# Altium project Energy_meter.PrjPcb
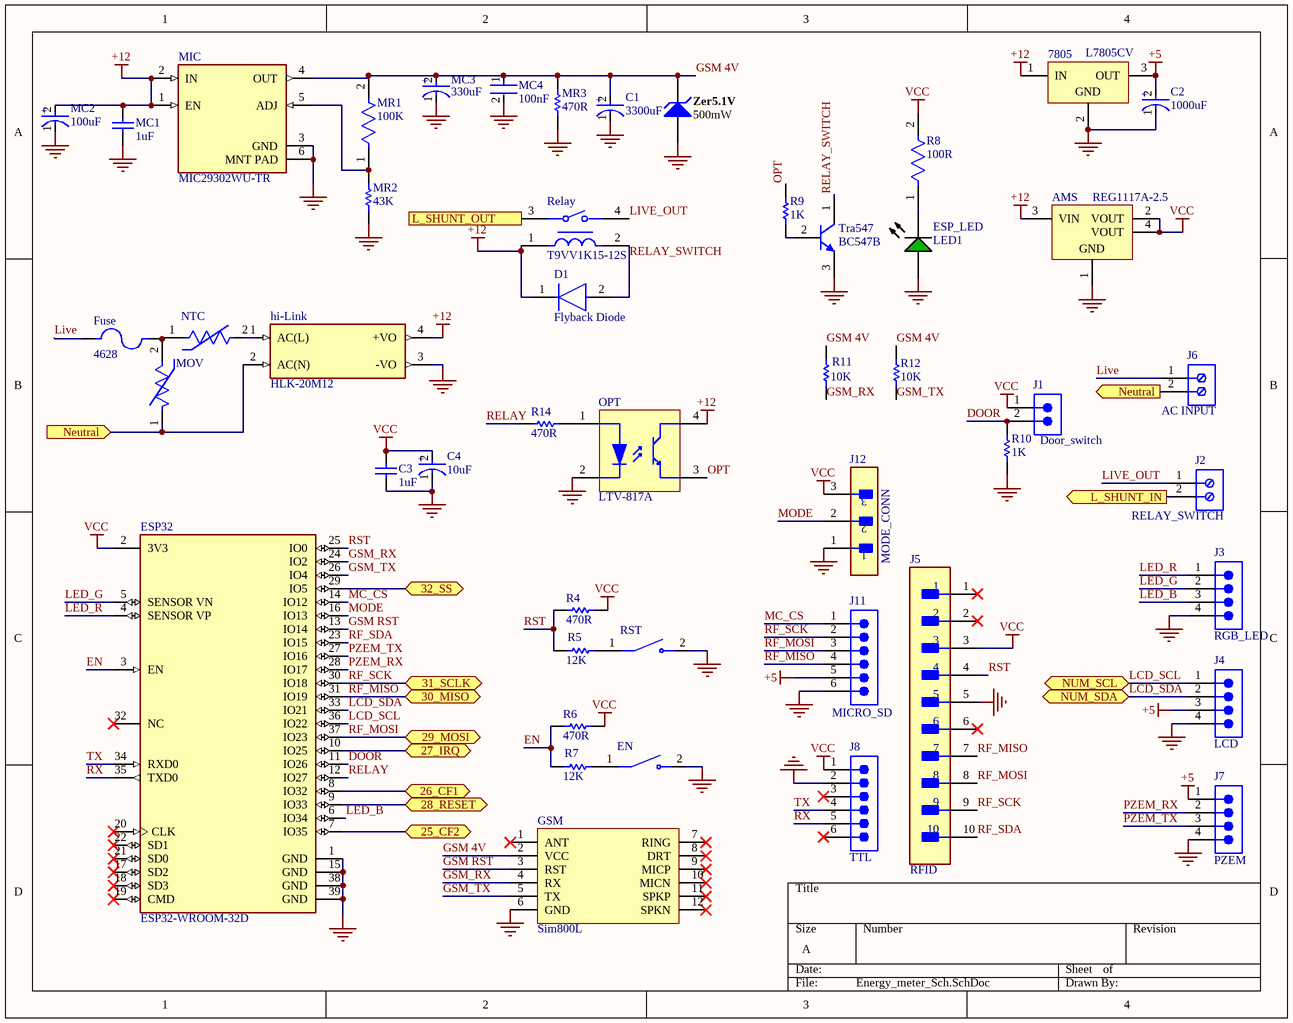
[diagram p0: Energy_meter_Sch.SchDoc]
2 sheets, 87 parts. Net scope: flat (ports and power ports of the same name join across sheets).
Board file: Energy_meter.PcbDoc
Sheets:
  Energy_meter_Sch.SchDoc
  EnergyMeter_ADE9153.SchDoc

## Sheet Energy_meter_Sch.SchDoc
size A; SheetNumber: 1; SheetTotal: 2

### Parts
7805  L7805CV  [TO220]
AMS  REG1117A-2.5  [DCY0004A_L]
C1  3300uF  [FP-RAD-TH-D_12_5_0_5-L_40-MFG]
C2  1000uF  [FP-RAD-TH-D_12_5_0_5-L_20-MFG]
C3  1uF  [CAPC2013X145X50ML20T25]
C4  10uF  [FP-SC-MFG]
D1  Flyback Diode  [FP-1N4007-MFG]
EN  TS09-63-25-WT-160-SMT-TR  [SW_TS09-63-25-WT-160-SMT-TR]  (value not drawn)
ESP32  ESP32-WROOM-32D  [FP-ESP32-WROOM-32D-MFG]
ESP_LED  LED1  [AVAG-HSMX-C170_V]
Fuse  4628  [FUSE_4628]
GSM  Sim800L  [Sim800L]
hi-Link  HLK-20M12  [CONV_HLK-20M12]
J1  Door_switch  [61300211121]
J2  RELAY_SWITCH  [691137710002]
J3  RGB_LED  [61300411121]
J4  LCD  [61300411121]
J5  RFID  [FP-B10B-XH-A_LF_SN-MFG]
J6  AC INPUT  [691137710002]
J7  PZEM  [61300411121]
J8  TTL  [61300611121]
J11  MICRO_SD  [61300611121]
J12  MODE_CONN  [FP-22-28-4030-MFG]
MC1  1uF  [CAPC2013X145X50LL20T25]
MC2  100uF  [FP-SC-MFG]
MC3  330uF  [FP-FPG-MFG]
MC4  100nF  [FP-0805-L_2_01_0_2-W_1_25-IPC_B]
MIC  MIC29302WU-TR  [FP-C04-012-MFG]
MOV  MOV1  [FP-MOV-10D201KTR-MFG]  (value not drawn)
MR1  100K  [FP-RN732A-MFG]
MR2  43K  [RESC2013X60X40NL20T25]
MR3  470R  [RESC2013X70X40ML20T20]
NTC  NTC1  [FP-NTPAA-MFG]  (value not drawn)
OPT  LTV-817A  [LTST-LTV-817-4]
R4  470R  [RESC2013X60X40ML20T25]
R5  12K  [RESC2013X60X40ML20T25]
R6  470R  [RESC2013X60X40ML20T25]
R7  12K  [RESC2013X60X40ML20T25]
R8  100R  [FP-RN732A-MFG]
R9  1K  [RESC2013X60X40ML20T25]
R10  1K  [RESC2013X60X35ML10T20]
R11  10K  [RESC2013X60X40ML20T25]
R12  10K  [RESC2013X60X40ML20T25]
R14  470R  [RESC2013X60X40ML20T25]
Relay  T9VV1K15-12S  [FP-T9VV1K15-12S-MFG]
RST  TS09-63-25-WT-160-SMT-TR  [SW_TS09-63-25-WT-160-SMT-TR]  (value not drawn)
Tra547  BC547B  [ONSC-TO-92-3-29-11]
Zer5.1V  500mW  [FAIR-DO-41-2_V]

### Ports
25_CF2 (bidir, see EnergyMeter_ADE9153), 26_CF1 (bidir, see EnergyMeter_ADE9153), 27_IRQ (bidir, see EnergyMeter_ADE9153), 28_RESET (bidir, see EnergyMeter_ADE9153), 29_MOSI (bidir, see EnergyMeter_ADE9153), 30_MISO (bidir, see EnergyMeter_ADE9153), 31_SCLK (bidir, see EnergyMeter_ADE9153), 32_SS (bidir, see EnergyMeter_ADE9153), L_SHUNT_IN (out, see EnergyMeter_ADE9153), L_SHUNT_OUT (in, see EnergyMeter_ADE9153), Neutral (in, see Energy_meter_Sch, EnergyMeter_ADE9153), Neutral (out, see Energy_meter_Sch, EnergyMeter_ADE9153), NUM_SCL (bidir, see EnergyMeter_ADE9153), NUM_SDA (bidir, see EnergyMeter_ADE9153)

### Nets
+5: 7805.3(OUT) C2.2(A) J4.3 J7.1 J11.5
+12: 7805.1(IN) AMS.3(VIN) D1.1(C) hi-Link.4(+VO) MC1.2 MC2.2(A) MIC.1(EN) MIC.2(IN) OPT.4(COLLECTOR) Relay.1
GND: 7805.2(GND) AMS.1(GND) C1.1(C) C2.1(C) C3.1 C4.1(C) EN.2 ESP32.1(GND) ESP32.15(GND) ESP32.38(GND) ESP32.39(GND) ESP_LED.1(A) GSM.6(GND) hi-Link.3(-VO) J2.2 J3.4 J4.4 J5.5 J7.4 J8.2 J11.6 J12.1 MC1.1 MC2.1(C) MC3.1(C) MC4.2 MIC.3(GND) MIC.6(MNT_PAD) MR2.1 MR3.1 OPT.2(CATHODE) R10.1 RST.2 Tra547.3(E) Zer5.1V.1(A) ; port L_SHUNT_IN
VCC: AMS.2(VOUT) AMS.4(VOUT) C3.2 C4.2(A) ESP32.2(3V3) J1.1 J5.3 J8.1 J12.3 R4.2 R6.2 R8.2
6_IAMS: Relay.3 ; port L_SHUNT_OUT
DOOR: ESP32.11(IO26) J1.2 R10.2
EN: ESP32.3(EN) R6.1 R7.1
GSM 4V: C1.2(A) GSM.2(VCC) MC3.2(A) MC4.1 MIC.4(OUT) MR1.2 MR3.2 R11.2 R12.2 Zer5.1V.2(K)
GSM RST: ESP32.13(IO14) GSM.3(RST)
GSM_RX: ESP32.24(IO2) GSM.4(RX) R11.1
GSM_TX: ESP32.26(IO4) GSM.5(TX) R12.1
LCD_SCL: ESP32.36(IO22) J4.1 ; port NUM_SCL
LCD_SDA: ESP32.33(IO21) J4.2 ; port NUM_SDA
LED_B: ESP32.6(IO34) J3.3
LED_G: ESP32.5(SENSOR_VN) J3.2
LED_R: ESP32.4(SENSOR_VP) J3.1
Live: Fuse.1 J6.1
LIVE_OUT: J2.1 Relay.4
MC_CS: ESP32.14(IO12) J11.1
MODE: ESP32.16(IO13) J12.2
OPT: OPT.3(EMITTER) R9.2
PZEM_RX: ESP32.28(IO17) J7.2
PZEM_TX: ESP32.27(IO16) J7.3
RELAY: ESP32.12(IO27) R14.1
RELAY_SWITCH: D1.2(A) Relay.2 Tra547.1(C)
RF_MISO: ESP32.31(IO19) J5.7 J11.4 ; port 30_MISO
RF_MOSI: ESP32.37(IO23) J5.8 J11.3 ; port 29_MOSI
RF_SCK: ESP32.30(IO18) J5.9 J11.2 ; port 31_SCLK
RF_SDA: ESP32.23(IO15) J5.10
RST: ESP32.25(IO0) J5.4 R4.1 R5.1
RX: ESP32.35(TXD0) J8.5
TX: ESP32.34(RXD0) J8.4
NetADE_25: ESP32.7(IO35) ; port 25_CF2
NetADE_26: ESP32.8(IO32) ; port 26_CF1
NetADE_27: ESP32.10(IO25) ; port 27_IRQ
NetADE_28: ESP32.9(IO33) ; port 28_RESET
NetADE_32: ESP32.29(IO5) ; port 32_SS
NetEN_1: EN.1 R7.2
NetESP_LED_2: ESP_LED.2(K) R8.1
NetFuse_2: Fuse.2 MOV.2 NTC.1
Nethi-Link_1: hi-Link.1(AC(L)) NTC.2
Nethi-Link_2: hi-Link.2(AC(N)) J6.2 MOV.1 ; port Neutral
NetMIC_5: MIC.5(ADJ) MR1.1 MR2.2
NetOPT_1: OPT.1(ANODE) R14.2
NetR5_2: R5.2 RST.1
NetR9_1: R9.1 Tra547.2(B)

Not connected (* = marked no-connect by the designer): ESP32 17(SD2)* 18(SD3)* 19(CMD)* 20(CLK)* 21(SD0)* 22(SD1)* 32(NC)*; GSM 1(ANT)* 7(RING)* 8(DRT)* 9(MICP)* 10(MICN)* 11(SPKP)* 12(SPKN)*; J5 1* 2* 6*; J8 3* 6*

### Notes on the sheet
- (in symbol CMP-05427-000047-1) +
- (in symbol CMP-05427-000057-1) +
- (in symbol CMP-05427-000087-1) +
- (in symbol CMP-05427-000606-1) +
- (in symbol CMP-05427-001733-1) +

### Library data of the parts
7805 = CMP-0244-00483-1: Positive Voltage Regulator, 5V, 3-Pin TO-220; PackageDescription: TO, Thru-Hole, Vertical, Heatsink Mounted; 3 In-Line Leads; Pitch 2.54 mm; ComponentLink2Description: Datasheet; PackageReference: TO220; ComponentLink3URL: http://www.st.com/internet/com/TECHNICAL_RESOURCES/TECHNICAL_LITERATURE/PACKAGE_INFORMATION/CD00004649.pdf; DatasheetVersion: 16/11/2011; ComponentLink1Description: Manufacturer URL; ComponentLink1URL: http://www.st.com; PackageVersion: ver3.0; ComponentLink3Description: Package Specification; ComponentLink2URL: http://www.st.com/internet/com/TECHNICAL_RESOURCES/TECHNICAL_LITERATURE/DATASHEET/CD00000444.pdf
AMS = CMP-0395-00519-2: Single Output LDO, 1 A, Fixed 2.5 V Output, 3.8 to 15 V Input, with Internal Current Limiting, 4-pin SOT-223 (DCY), -40 to 125 degC, Green (RoHS & no Sb/Br); Manufacturer: Texas Instruments; SubFamily: Single Channel LDO; Vdo(Typ)(mV): 1200; Vin(Min)(V): 3.8; Fixed Output Options(V): 2.5; Rating: Catalog; Vin(Max)(V): 15; Iout(Max)(A): 1; Iq(Typ)(mA): 4; Eco-Plan: Green (RoHS & no Sb/Br); PackageReference: DCY0004A; PartNumber: REG1117A-2.5; DatasheetVersion: SBVS001D; ComponentLink1Description: Manufacturer URL; Vout Adj(Min)(V): 2.5; Mounting Technology: Surface Mount; PackageDescription: 4-Pin Plastic Small Outline, Body 3.5 x 6.5 mm, Pitch 2.3 mm; Vout Adj(Max)(V): 2.5; Code_JEDEC: TO-261; ComponentLink3URL: http://www.ti.com/litv/pdf/mpds094a; ComponentLink2URL: http://www.ti.com/general/docs/lit/getliterature.tsp?genericPartNumber=REG1117A-25&fileType=pdf; ComponentLink2Description: Datasheet; ComponentLink3Description: Package Specification; PackageVersion: 4202506/B; ComponentLink1URL: http://www.ti.com/
C1 = CMP-05427-001733-1: Aluminum Electrolytic Capacitors (Radial Lead Type) AEC-Q200 Qualified 3300uF ±20% 25V; Life (Hours): 5000Hour; Dielectric Material: Aluminium; Impedance: 14mR; Capacitance: 3.3mF; Ripple Current: 3.01A; Lead Diameter: 0.8mm; Contact Plating: Tin; Min Operating Temperature: -55°C; Termination: Radial; REACH SVHC: No SVHC; RoHS Compliant: Yes; Series: FK; Number of Pins: 2; Package Quantity: 100; Case/Package: Radial; Lead Pitch: 5mm; Voltage Rating (DC): 25V; Radiation Hardening: No; Tolerance: 20%; Construction: RADIAL; Mount: Through Hole; Diameter: 12.5mm; Packaging: Bulk; Max Operating Temperature: 105°C; Voltage Rating: 25V; Voltage: 25V; Height: 40mm
C2 = CMP-05427-000606-1: Aluminum Electrolytic Capacitors (Radial Lead Type) 1000uF ±20% 25V; Lead Length: 17mm; ESR (Equivalent Series Resistance): 18mR; Dissipation Factor: 0.14%; Lead Diameter: 0.6mm; Dielectric Material: Aluminium; Capacitance: 1mF; Life (Hours): 5000Hour; Ripple Current: 2.6A; Contact Plating: Tin; Voltage: 25V; Length: 20mm; Packaging: Bulk; RoHS Compliant: Yes; REACH SVHC: Yes; Lead Free: Lead Free; Tolerance: 20%; Features: General Purpose; Construction: RADIAL; Lead Pitch: 5mm; Impedance: 18mR; Min Operating Temperature: -40°C; Case/Package: Radial; Diameter: 12.5mm; Height - Seated (Max): 0.787inch; Package Quantity: 200; Mount: Through Hole; Max Operating Temperature: 105°C; Series: FM; Height: 20mm; Voltage Rating (DC): 25V; Termination: Radial; Voltage Rating: 25V; Radiation Hardening: No
C3 = CMP-1036-04731-2: Part Number: C0805C105K9PACTU; Manufacturer: Kemet
C4 = CMP-05427-000087-1: CAP ALUM 10UF 20% 35V SMD; Life (Hours): 2000Hour; Lead Length: 2.2mm; Ripple Current (AC): 30mA; Leakage Current: 3uA; Length: 5.5mm; Construction: Cylindrical; Diameter: 5mm; RoHS Compliant: Yes; REACH SVHC: No SVHC; Capacitance: 10uF; Max Operating Temperature: 85°C; Series: S; Case/Package: Radial; Contact Plating: Tin; Packaging: Tape and Reel; Voltage Rating: 35V; Number of Pins: 2; Height: 5.4mm; Width: 5.3mm; Voltage Rating (DC): 35V; Mount: Surface Mount; Tolerance: 20%; Lead Pitch: 1.5mm; Radiation Hardening: No; Height - Seated (Max): 0.213inch; Ripple Current: 30mA; Voltage: 35V; Package Quantity: 1; Termination: SMD/SMT; Min Operating Temperature: -40°C
D1 = CMP-02540-000046-1: DIODE GEN PURP 1KV 1A DO204AL; Manufacturer: Vishay; Manufacturer Part Number: 1N4007-E3/54; Value: 15pF; Max Junction Temp: +150°C; Max Surge Forward Current: 30A; Max Repetitive Reverse Voltage: 1000V; Peak Reverse Current: 30uA; Octopart: https://octopart.com/1n4007-e3%2F54-vishay-39548207; Digikey Description: DIODE GEN PURP 1KV 1A DO204AL; Category: Diode; Mouser Description: Rectifiers Vr/1000V Io/1A; Automotive: No; Package: 1N4007; Device Class L3: Rectifier Diodes; Temperature Range High: +150°C; Capacitance: 15pF; Ipc Land Pattern Name: DIOPA1088W105L520D270; Lead Free: Yes; ComponentLink2Description: Datasheet; Forward Current: 1A; Device Class L1: Discrete Semiconductors; ComponentLink2URL: http://www.vishay.com/docs/88503/1n4001.pdf; Temperature Range Low: -50°C; Height: 2.7mm; RoHS: TRUE; Temperature: -50°C to +150°C; Device Class L2: Diodes
ESP32 = CMP-194065-000003-1: WIFI MODULE 32MBITS SPI FLASH; Manufacturer: Espressif Systems; Max Supply Voltage: 3.6V; Nominal Supply Current: 500mA; Max Frequency: 2484MHz; Number Of Adc Channels: 16; Number Of Gpio: 32; Interface: I2C,SPI,UART,Ethernet,I2S,Other; Data Rate: 150Mbits/s; Min Supply Voltage: 3V; Bandwidth: 72MHz; Sensitivity: -98dBm; Octopart: https://octopart.com/esp32-wroom-32d-espressif+systems-91040050; Package: ESP32-WROOM-32D; ComponentLink2URL: https://www.espressif.com/sites/default/files/documentation/esp32-wroom-32d_esp32-wroom-32u_datasheet_en.pdf; Lead Free: Yes; Category: UNK; Mouser Description: Wi-Fi/BT BLE Module ESP32-D0WD, SPI Flash, UART, P; Device Class L1: Integrated Circuits (ICs); RoHS: TRUE; Temperature Range Low: -40°C; ComponentLink2Description: Datasheet; Digikey Description: WIFI MODULE 32MBITS SPI FLASH; Height: 3.2mm; Temperature: -40°C to +85°C; Manufacturer Part Number: ESP32-WROOM-32D; Device Class L3: Transceivers; Device Class L2: RF Semiconductors and Devices; Temperature Range High: +85°C; Automotive: No
ESP_LED = CMP-2000-05062-1: Chip LED, Green, 2.2 V, -40 to 85 degC, 2-Pin SMD, Pb-Free, Tape and Reel; Manufacturer: Avago; No. of Pins: 2; Peak Wavelength: 570nm; SVHC: NoSVHC(16-Jun-2014); Dominant Wavelength: 572nm; Forward Current If: 20mA; Viewing Angle: 170deg; Lens Shape: Rectangular; PIV Max: 5V; External Width: 1.25mm; LED Type: Standard; External Depth: 0.8mm; Opto Mounting Orientation: Top; Luminous Intensity: 15mcd; Luminous Intensity Min: 4mcd; Forward Voltage VF Max: 2.6V; External Length / Height: 2mm; Bulb Size: 1.25mmx1.4mm; Light Area Height: 1mm; Voltage Vf Typ: 2.2V; Operating Temperature Max: 85degC; Datasheet Version: Oct-08; MSL: MSL2A-4weeks; Peak Forward Current: 20mA; Package Description: 2-Pin Surface Mount Device, Body 2 x 1.25 mm, Height 0.8 mm; Datasheet URL: https://datasheet.ciiva.com/29280/180495-da-01-en-chip-led-hsmg-c170-gelb-gruen-29280971.pdf; Storage Temperature Min: -40degC; LED Colour: Green; Wavelength Typ: 570nm; Mounting Type: SMD; Forward Current If Max: 20mA; Dominant Wavelength Typ: 572nm; LED Mounting: SMD; Operating Temperature Range: -30degCto+85degC; Operating Temperature Min: -30degC; Manufacturer URL: http://www.avagotech.com/; Packaging: CutTape; Luminous Intensity Typ: 15mcd; Package Reference: HSMX-C170; Storage Temperature Max: 85degC; Opto Case Style: SMD; Forward Voltage: 2.2V
Fuse = 4628: 5mm Slim Line Fuse holder; MF: Keystone; Check_prices: https://www.snapeda.com/parts/4628/Keystone/view-part/?ref=eda; Value: *; Availability: In Stock; MP: 4628; Price: None; Package: None; SnapEDA_Link: https://www.snapeda.com/parts/4628/Keystone/view-part/?ref=snap; Purchase-URL: https://pricing.snapeda.com/search/part/4628/?ref=eda
hi-Link = HLK-20M12: 20W ultra-small series module power supply; MF: Hi-link; Check_prices: https://www.snapeda.com/parts/HLK-20M12/Hi-link/view-part/?ref=eda; SnapEDA_Link: https://www.snapeda.com/parts/HLK-20M12/Hi-link/view-part/?ref=snap; Availability: Not in stock; Price: None; Value: *; MP: HLK-20M12; Package: Non-Standard Hi-link
J1 = CMP-1712-00002-5: NexarPartId: 20081794; Operating Supply Voltage: 250V; Current Rating: 3A; Gender: Male; Number of Contacts: 2; Pitch: 2.54mm; Connector Type: Male Pin; Contact Resistance: 20mΩ; Contact Plating: Gold; Contact Material: Copper; Number of Pins: 2; Min Operating Temperature: -40°C; Packaging: Bulk; Lead Pitch: 2.54mm; Mount: Through Hole; Orientation: Vertical; RoHS: Compliant; REACH SVHC: No SVHC; Height: 8.94mm; Termination: Through Hole; Number of Positions: 2; Contact Mating Length: 5.9944mm; Color: Black; Contact Gender: Male; Number of Rows: 1; Housing Material: PBT; Lead Free: Lead Free; Voltage Rating: 250V; Max Operating Temperature: 125°C
J2 J6 = CMP-1502-03324-2: NexarPartId: 78871135; Voltage Rating: 300V; Number of Contacts: 2; Current Rating: 16A; Lead Pitch: 5mm; Height: 11.6mm; Packaging: Box; RoHS: Non-Compliant; Contact Material: Nickel, Tin; Max Operating Temperature: 120°C; Number of Pins: 2; Min Operating Temperature: -30°C; Number of Rows: 1
J3 J4 J7 = CMP-1502-01064-2: NexarPartId: 32855522; Pitch: 2.54mm; Number of Contacts: 4; Contact Resistance: 20mΩ; Gender: Male; Current Rating: 3A; Connector Type: Male Pin; Voltage Rating: 250V; Lead Free: Lead Free; Contact Plating: Gold; Max Operating Temperature: 105°C; Packaging: Bulk; Height: 8.89mm; Orientation: Vertical; Contact Mating Length: 5.9944mm; Contact Material: Copper; Lead Pitch: 2.54mm; Min Operating Temperature: -40°C; Termination: Solder; Color: Black; Number of Rows: 1; REACH SVHC: Unknown; RoHS: Compliant; Mount: Through Hole; Number of Positions: 4; Number of Pins: 4; Operating Supply Voltage: 250V
J5 = CMP-17439-000145-1: CONN HEADER VERT 10POS 2.5MM; Voltage Rating: 250V; Current Rating: 3A; Wire/Cable Gauge: 22AWG; Number of Contacts: 10; Contact Resistance: 20mR; Mated Stacking Heights: 9.8mm; Gender: Male; Insulation Resistance: 1GR; Series: XH; Max Current Rating: 3A; Contact Shape: Square; Contact Material: Brass; Housing Material: Polyamide; Lead Free: Lead Free; Orientation: Straight; Max Voltage Rating (DC): 250V; Contact Type: Male Pin; Number of Positions: 10; Length: 27.4mm; Housing Color: White; Max Voltage Rating (AC): 250V; Depth: 5.75mm; Mount: Through Hole; Pitch: 2.5mm; Fastening Type: Detent; Flammability Rating: UL94 V-0; Color: Natural; Contact Plating: Tin; Insulation Color: Natural; Packaging: Bulk; REACH SVHC: No SVHC; Insulation Material: Nylon; Connector Type: Header; Lead Pitch: 2.5mm; Contact Finish - Mating: TIN; Voltage Rating (AC): 250V; Number of Rows: 1; Max Operating Temperature: 85°C; Min Operating Temperature: -25°C; Termination: Solder
J8 J11 = CMP-1502-01070-2: NexarPartId: 20084590; Operating Supply Voltage: 250V; Current Rating: 3A; Number of Contacts: 6; Gender: Male; Connector Type: Male Pin; Pitch: 2.54mm; Contact Resistance: 20mΩ; Lead Free: Lead Free; REACH SVHC: Unknown; Number of Rows: 1; Color: Black; Min Operating Temperature: -40°C; Contact Material: Copper; Lead Pitch: 2.54mm; Contact Plating: Gold; Number of Pins: 6; Height: 8.89mm; Orientation: Vertical; Termination: Through Hole; Mount: Through Hole; RoHS: Compliant; Contact Gender: Male; Contact Mating Length: 5.9944mm; Voltage Rating: 250V; Number of Positions: 6; Housing Material: PBT; Packaging: Bulk; Max Operating Temperature: 105°C
J12 = CMP-04776-000098-1: CONN HEADER VERT 3POS 2.54MM; Manufacturer: Molex; Conn Orientation: Vertical; Conn Gender: Male; Current Rating: 4A; Voltage Rating: 500V; Number Of Contacts: 3; Category: Conn; Number Of Rows: 1; Manufacturer Part Number: 22-28-4030; RoHS: TRUE; Package: 22-28-4030; Footprint Url: https://www.molex.com/pdm_docs/sd/022284030_sd.pdf; ComponentLink2Description: Datasheet; Device Class L2: Headers and Wire Housings; Automotive: No; Temperature Range Low: -40°C; Digikey Description: CONN HEADER VERT 3POS 2.54MM; Mouser Description: Headers & Wire Housings 3P VERT HEADER Sn; Contact Material: Gold,Nickel; Pitch: 2.54mm; Device Class L1: Connectors; Lead Free: Yes; Device Class L3: unset; Temperature Range High: +80°C; Octopart: https://octopart.com/0022284030-molex-10476094; ComponentLink2URL: https://www.molex.com/webdocs/datasheets/pdf/en-us/0022284030_PCB_HEADERS.pdf; Height: 8.88mm; Temperature: -40°C to +80°C
MC1 = CMP-1036-04746-2: Manufacturer: Kemet; Part Number: C0805C105K4PACTU
MC2 = CMP-05427-000047-1: CAP ALUM 100UF 20% 10V SMD; Life (Hours): 1000Hour; Ripple Current: 50mA; Packaging: Tape and Reel; Diameter: 5mm; Voltage Rating (DC): 10V; Mount: Surface Mount; Max Operating Temperature: 85°C; Length: 5.5mm; Case/Package: Radial; Height: 5.4mm; Construction: Cylindrical; Termination: SMD/SMT; Height - Seated (Max): 0.213inch; Series: S; Min Operating Temperature: -40°C; Capacitance: 100uF; Tolerance: 20%; Voltage Rating: 10V; Package Quantity: 1; Radiation Hardening: No; Ripple Current (AC): 50mA; Lead Free: Lead Free; RoHS Compliant: Yes; Contact Plating: Tin
MC3 = CMP-05427-000057-1: CAP ALUM 330UF 20% 35V SMD; ESR (Equivalent Series Resistance): 60mR; Dielectric Material: Aluminium; Life (Hours): 2000Hour; Ripple Current (AC): 1.19A; Leakage Current: 115.5uA; Polarity: Polar; Lead Free: Lead Free; Height - Seated (Max): 0.402inch; Diameter: 10mm; RoHS Compliant: Yes; Construction: Cylindrical; Material: Aluminium; Case/Package: Radial; Voltage Rating (DC): 35V; Voltage: 35V; Voltage Rating: 35V; Capacitance: 330uF; Height: 10.2mm; Lead Pitch: 4.6mm; Tolerance: 20%; Contact Plating: Tin; Number of Pins: 2; Width: 10.3mm; Termination: SMD/SMT; Max Operating Temperature: 105°C; Packaging: Tape and Reel; Package Quantity: 500; REACH SVHC: No SVHC; Series: FP; Min Operating Temperature: -55°C; Ripple Current: 1.19A; Mount: Surface Mount; Length: 10.5mm; Radiation Hardening: No
MC4 = CMP-2007-04174-2: General Purpose Ceramic Capacitor, 0805, 100nF, 10%, X7R, 15%, 100V; Packaging: Tape and Reel; Min Operating Temperature: -55°C; Dielectric Material: Ceramic; Height: 1.4mm; Voltage Rating: 100V; Termination: SMD/SMT; Case Code (Imperial): 0805; Case Code (Metric): 2012; Case/Package: 0805; Construction: Flat; Radiation Hardening: No; Series: -; Dielectric: X7R; Package Quantity: 2000; Mount: Surface Mount; Capacitance: 100nF; Contact Plating: Tin; Voltage: 100V; Lead Free: Lead Free; Depth: 1.25mm; RoHS Compliant: Yes; Number of Pins: 2; Max Operating Temperature: 125°C; Length: 2.01mm; Voltage Rating (DC): 100V; Thickness: 0.055inch; REACH SVHC: No SVHC; Width: 0.049inch; Tolerance: 10%
MIC = CMP-06324-000007-1: IC REG LINEAR POS ADJ 3A TO263-5; Manufacturer: Microchip; Output Voltage: 3.3-12V; Output Type: AdjustableProgrammable; Max Junction Temp: +125°C; Standoff Height: 0mm; Accuracy Percentage: 1%; Max Supply Voltage: 26V; Nominal Supply Current: 10-37mA; Number Of Outputs: 1; Dropout Voltage: 370mV; Min Supply Voltage: 2.25V; ComponentLink2URL: http://ww1.microchip.com/downloads/en/DeviceDoc/MIC2915x-30x-50x-75x-High-Current-Low-Dropout-Regulators-DS20005685B.pdf; Device Class L1: Integrated Circuits (ICs); Digikey Description: IC REG LINEAR POS ADJ 3A TO263-5; Device Class L2: Power Management ICs; Lead Free: Yes; Mouser Description: LDO Voltage Regulators; Package: C04-012; Temperature: -40°C to +125°C; ComponentLink2Description: Datasheet; Temperature Range High: +125°C; Automotive: No; Device Class L3: Voltage Regulators - Linear; Category: IC; Temperature Range Low: -40°C; RoHS: TRUE; Output Current: 3A; Octopart: https://octopart.com/mic29302wu-tr-microchip-66801318; Manufacturer Part Number: MIC29302WU-TR; Height: 0.2inch
MOV = CMP-07402-000009-1: VARISTOR 200V 2.5KA DISC 10MM; Manufacturer: Bourns Inc.; Manufacturer Part Number: MOV-10D201KTR; Voltage Rating Ac: 130V; Varistor Voltage: 185V; Voltage Rating Dc: 170V; Voltage Tolerance: 10%; Clamping Voltage: 340V; Capacitance: 600pF; Clamping Current: 25A; Value: 600pF; Device Class L2: Varistors; Automotive: No; Octopart: https://octopart.com/mov-10d201ktr-bourns-19184757; Temperature: -40°C to +105°C; RoHS: TRUE; Height: 15.5mm; Category: Res; Mouser Description: Varistors 250pF 200volts 10%; Lead Free: Yes; ComponentLink2Description: Datasheet; ComponentLink2URL: https://www.bourns.com/docs/Product-Datasheets/MOV10D.pdf; Temperature Range High: +105°C; Device Class L3: unset; Temperature Range Low: -40°C; Package: 0; Digikey Description: VARISTOR 200V 2.5KA DISC 10MM; Device Class L1: Circuit Protection
MR1 = CMP-03211-002801-1: SMD Chip Resistor, Thin Film, 100KΩ, 100 V, 0805 [2012 Metric], 100 mW, 0.1%, RN73 Series; Manufacturer Part Number: RN73C2A100KBTDF; Manufacturer: TE Connectivity; Temperature Coefficient: 10ppm/°C; Voltage Rating: 100V; Power Rating: 0.1W; Ipc Land Pattern Name: RESC200125X55; ComponentLink2URL: https://www.te.com/commerce/DocumentDelivery/DDEController?Action=showdoc&DocId=Data+Sheet%7F1773270%7FP%7Fpdf%7FEnglish%7FENG_DS_1773270_P.pdf%7F1676162-2; Package: RN732A; octopart_url: https://octopart.com/rn73c2a100kbtdf-te+connectivity-21411916; Lead Free: Yes; Temperature Range Low: -55°C; Temperature Range High: 155°C; Octopart: https://octopart.com/rn73c2a100kbtdf-te+connectivity-21411916; ComponentLink2Description: Datasheet; Category: Res; Device Class L1: Passive Components; Resistance: 100KΩ; Device Class L3: Chip SMD Resistors; Tolerance: 0.1%; packaging: 1000 Reel; Series: RN73; Value: 100KΩ; Composition: Thin Film; Temperature: -55°C to 155°C; RoHS: TRUE; Automotive: No; Device Class L2: Resistors; Height: 0.65mm
MR2 = CMP-2001-00640-1: Manufacturer: Panasonic; Part Number: ERA6AEB433V
MR3 = CMP-2001-00549-5: Chip Resistor, 470 Ohm, +/- 1%, 0.125 W, -55 to 155 degC, 0805 (2012 Metric), RoHS, Tape and Reel; Manufacturer: Panasonic; Voltage Rating: 150 V; ComponentLink1URL: http://www.panasonic.com/; ComponentLink2Description: Datasheet; RoHSCompliant: true; PackageDescription: 2-Pin Surface Mount Device, Body 2 x 1.25 mm; PackageReference: 0805; REACH SVHC: Yes; Max Operating Temperature: 155 degC; Mount: Surface Mount; Min Operating Temperature: -55 degC; DatasheetVersion: 04/2015; Mounting Technology: Surface Mount; Height: 0.6 mm; Package Quantity: 1; ComponentLink2URL: http://industrial.panasonic.com/cdbs/www-data/pdf/RDA0000/AOA0000C86.pdf; Length: 2 mm; ComponentLink1Description: Manufacturer URL; Pins: 2; Packaging: Cut Tape
NTC = CMP-06022-000066-1: ICL 3.9 OHM 15% 2.7A 10MM; Resistance: 3.9R; Lead Diameter: 0.8mm; Voltage: 264V; Current Rating: 2.3A; Mount: Through Hole; Packaging: Bulk; Max Operating Temperature: 160°C; Package Quantity: 100; Diameter: 0.394inch; Thickness: 5mm; Lead Pitch: 0.295inch; Width: 5mm; Number of Pins: 2; Depth: 5mm; Lead Free: Lead Free; Tolerance: 15%; Min Operating Temperature: -20°C
OPT = CMP-2000-05203-1: Optocoupler DC-IN 1-CH Transistor DC-OUT, 10 uA Max, 1.2 V, -30 to 110 degC, 4-Pin DIP, RoHS, Tube; Output Type: DC; Number of Channels: 1Channel; Maximum Fall Time: 18us; Maximum Collector Emitter Voltage: 35V; Maximum Input Diode Current: 50mA; Maximum Forward Diode Voltage: 1.4V; Maximum Power Dissipation: 200mW; Maximum Reverse Diode Voltage: 6V; Isolation Voltage: 5000Vrms; Maximum Collector Emitter Saturation Voltage: 0.2V; Current Transfer Ratio: 160%; Output Device: NPNPhototransistor; Brand: Lite-On; Minimum Operating Temperature: -30C; Manufacturer URL: http://www.us.liteon.com/; Configuration: 1Channel; Input Type: DC; Maximum Operating Temperature: +100C; Datasheet URL: http://components.arrow.com/part/dataview/423620S3450502N1331; Maximum Collector Current: 50mA; Maximum Rise Time: 18us; Factory Pack Quantity: 100; Package Description: 4-Pin Double In-line Package, Body 6.5 x 4.6 mm, Pitch 2.54 mm; Datasheet Version: Rev. K, 03/2010; Number of Channels per Chip: 1Channel; Product Category: TransistorOutputOptocouplers; RoHS: Details; Package / Case: PDIP-4; Manufacturer: Lite-On; Package Reference: LTV-817; Packaging: Tube
R4-R7 R9 R11 R12 R14 = CMP-2001-00590-1: Part Number: ERA6AEB123V; Manufacturer: Panasonic
R8 = CMP-03211-000756-1: SMD Chip Resistor, Thin Film, 100Ω, 100 V, 0805 [2012 Metric], 100 mW, 0.1%, RN73 Series; Manufacturer Part Number: RN73C2A100RBTDF; Manufacturer: TE Connectivity; Voltage Rating: 100V; Temperature Coefficient: 10ppm/°C; Power Rating: 0.1W; Temperature Range Low: -55°C; Ipc Land Pattern Name: RESC200125X55; Series: RN73; ComponentLink2URL: https://www.te.com/commerce/DocumentDelivery/DDEController?Action=showdoc&DocId=Data+Sheet%7F1773270%7FP%7Fpdf%7FEnglish%7FENG_DS_1773270_P.pdf%7F1676162-2; Composition: Thin Film; Value: 100Ω; Device Class L1: Passive Components; Device Class L3: Chip SMD Resistors; Lead Free: Yes; Octopart: https://octopart.com/rn73c2a100rbtdf-te+connectivity-41188433; Temperature: -55°C to 155°C; packaging: 1000 Reel; Tolerance: 0.1%; Height: 0.65mm; Automotive: No; Temperature Range High: 155°C; Resistance: 100Ω; RoHS: TRUE; Category: Res; octopart_url: https://octopart.com/rn73c2a100rbtdf-te+connectivity-41188433; Package: RN732A; ComponentLink2Description: Datasheet; Device Class L2: Resistors
R10 = CMP-2100-03671-1: Chip Resistor, 1 KOhm, +/- 1%, 125 mW, -55 to 155 degC, 0805 (2012 Metric), RoHS, Tape and Reel; Manufacturer: Yageo; Temperature Coefficient: 100ppm/degreesC; Voltage Rating (DC): 150V; Max Power Dissipation: 125mW; Resistance: 1KOhm; Number of Pins: 2; Number of Terminations: 2; Datasheet URL: http://www.yageo.com/NewPortal/yageodocoutput?fileName=/pdf/R-Chip/PYu-RC_Group_51_RoHS_L_5.pdf; Length: 0.079inch; Package Description: 2-Pin Surface Mounted Device, Body 2 x 1.25 mm; Depth: 1.25mm; Height: 0.024inch; Military Standard: Not; Case/Package: 0805; Package Reference: 0805; RoHSCompliant: true; Lead Free: LeadFree; Packaging: TapeandReel; Package Quantity: 1; Datasheet Version: Rev. 5, 10/2016; Tolerance: 1%; Min Operating Temperature: -55degC; Voltage Rating: 150V; Composition: ThickFilm; Case Code (Imperial): 0805; Power Rating: 125mW; Width: 0.049inch; Case Code (Metric): 2012; Manufacturer URL: http://www.yageo.com/; Max Operating Temperature: 155degC; REACH SVHC: Unknown; Termination: SMD/SMT
Relay = CMP-03395-000162-1: RELAY GEN PURPOSE SPST 40A 12V; Manufacturer: TE Connectivity; Coil Type: Non-Latching; Coil Power: 2.25W; Throw Configuration: SPST-NO; Number Of Contacts: 1; Coil Resistance: 64Ω; Coil Voltage: 12V; Ambient Temperature Range High: +85°C; Octopart: https://octopart.com/t9vv1k15-12s-te+connectivity-86729601; Automotive: No; Mouser Description: Power Relay 12VDC 40A SPST-NO(32.51x27.43x20.4)mm THT Automotive; Current Rating: 40A; Category: Relay; Device Class L2: Relays; Ambient Temperature Range Low: -40°C; Height: 20.4mm; RoHS: TRUE; ComponentLink2Description: Datasheet; Package: 0; ComponentLink2URL: https://www.te.com/commerce/DocumentDelivery/DDEController?Action=showdoc&DocId=Data+Sheet%7FPower_PCB_Relay_T9V_Solar%7F0819%7Fpdf%7FEnglish%7FENG_DS_Power_PCB_Relay_T9V_Solar_0819.pdf%7F2027395-5; Lead Free: Yes; Digikey Description: RELAY GEN PURPOSE SPST 40A 12V; Device Class L3: Power Relays; Device Class L1: Electromechanical; Manufacturer Part Number: T9VV1K15-12S
Tra547 = CMP-1048-01467-1: Amplifier Transistor, NPN Silicon, 3-Pin TO-92, Bulk Box; Manufacturer: On Semiconductor; IC Continuous (A): 0.1; fT Min (MHz): 150; DatasheetVersion: Rev. 7; ComponentLink1URL: http://www.onsemi.com/; Polarity: NPN; RoHS: FALSE; ComponentLink1Description: Manufacturer URL; Packing: Bulk Box; PackageDescription: 3-Pin Transistor Outline, Body 4.825 x 3.685 mm, Pitch 1.27 mm; ComponentLink3URL: http://www.onsemi.cn/pub_link/Collateral/2N6426-D.PDF; ComponentLink2Description: Datasheet; PackageVersion: Rev. AM; PackageReference: TO-92-3-29-11_AM_SL; ComponentLink3Description: Package Specification; Mounting Technology: Through Hole; PartNumber: BC547B; ComponentLink2URL: http://www.onsemi.com/pub_link/Collateral/BC546-D.PDF
Zer5.1V = CMP-0892-00001-1: Zener Diode, 12V, 1W, 5%, -65 to 200 degC, 2-Pin DO-41, Body 2.72 x 5.2 mm, RoHS; PartNumber: 1N4742A; Manufacturer: Fairchild Semiconductor; PD (W): 1; VZ (Min.) (V): 11.4; VZ (Max.) (V): 12.6; ZZ (Max) (ohm): 8; IR (uA): 5; Test Current IZ (mA): 21; PackageVersion: Rev. 2; DatasheetVersion: Rev. H3; Mounting Technology: Through Hole; Tolerance: 5%; PackageDescription: 2-Pin Axial leaded, Body 2.72 x 5.2 mm, Lead Spread 25.4 mm; ComponentLink1Description: Manufacturer URL; ComponentLink3Description: Package Specification; ComponentLink2Description: Datasheet; ComponentLink2URL: http://www.fairchildsemi.com/ds/1N/1N4744A.pdf; PackageReference: DO-41-2; RoHS: TRUE; Operating and Storage Temperature Range: -65 to 200 degC; ComponentLink3URL: http://www.fairchildsemi.com/dwg/DO/DO41A.pdf; ComponentLink1URL: http://www.fairchildsemi.com/
EN RST = TS09-63-25-WT-160-SMT-TR: Price: None; Availability: Unavailable; Package: None; Value: *; MP: TS09-63-25-WT-160-SMT-TR

## Sheet EnergyMeter_ADE9153.SchDoc
size A; SheetNumber: 2; SheetTotal: 2
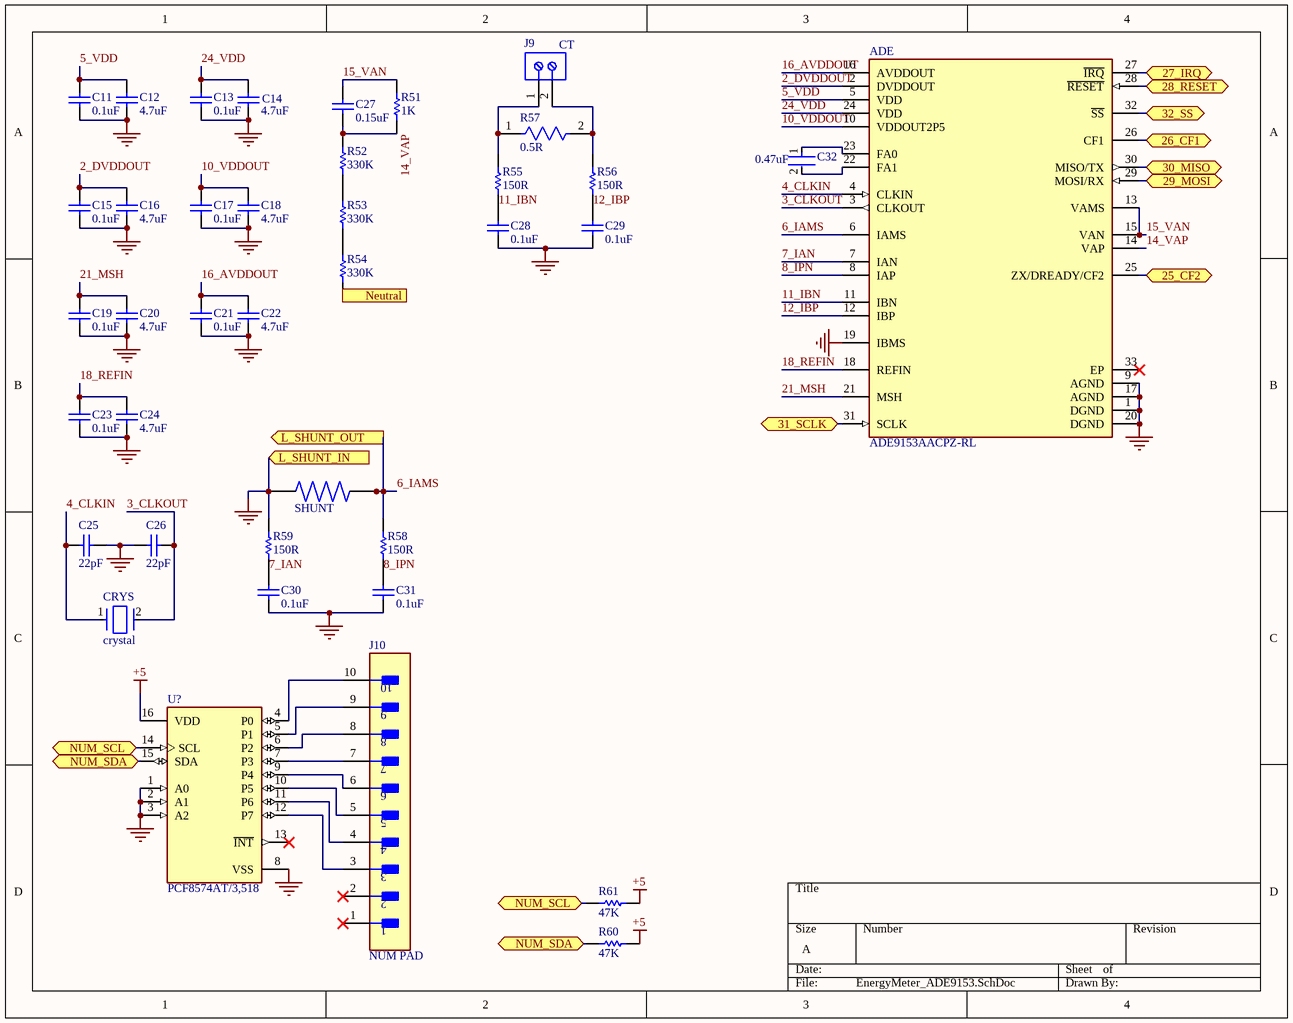
[diagram p1: EnergyMeter_ADE9153.SchDoc]

### Parts
ADE  ADE9153AACPZ-RL  [FP-CP-32-12-MFG]
C11  0.1uF  [CAPC2013X135X45ML10T25]
C12  4.7uF  [CAPC2013X135X45ML10T25]
C13  0.1uF  [CAPC2013X135X45ML10T25]
C14  4.7uF  [CAPC2013X135X45ML10T25]
C15  0.1uF  [CAPC2013X135X45ML10T25]
C16  4.7uF  [CAPC2013X135X45ML10T25]
C17  0.1uF  [CAPC2013X135X45ML10T25]
C18  4.7uF  [CAPC2013X135X45ML10T25]
C19  0.1uF  [CAPC2013X135X45ML10T25]
C20  4.7uF  [CAPC2013X135X45ML10T25]
C21  0.1uF  [CAPC2013X135X45ML10T25]
C22  4.7uF  [CAPC2013X135X45ML10T25]
C23  0.1uF  [CAPC2013X135X45ML10T25]
C24  4.7uF  [CAPC2013X135X45ML10T25]
C25  22pF  [CAPC2013X115X51NL20T26]
C26  22pF  [CAPC2013X115X51NL20T26]
C27  0.15uF  [CAPC2013X140X50LL20T25]
C28  0.1uF  [CAPC2013X135X45ML10T25]
C29  0.1uF  [CAPC2013X135X45ML10T25]
C30  0.1uF  [CAPC2013X135X45ML10T25]
C31  0.1uF  [CAPC2013X135X45ML10T25]
C32  0.47uF  [FP-C0805C-DN-MFG]
CRYS  crystal  [FP-CSM-7XDU-MFG]
J9  CT  [691214110002]
J10  NUM PAD  [FP-B10B-XH-A_LF_SN-MFG]
R51  1K  [RESC2013X60X35ML10T20]
R52  330K  [RESC2013X70X40LL20T20]
R53  330K  [RESC2013X70X40LL20T20]
R54  330K  [RESC2013X70X40LL20T20]
R55  150R  [RESC2013X60X40NL20T25]
R56  150R  [RESC2013X60X40NL20T25]
R57  0.5R  [FP-CSR0805-MFG]
R58  150R  [RESC2013X60X40NL20T25]
R59  150R  [RESC2013X60X40NL20T25]
R60  47K  [RESC2013X60X40ML20T25]
R61  47K  [RESC2013X60X40ML20T25]
SHUNT  SHUNT  [RES_WSK12161L000FEA]  (value not drawn)
U?  PCF8574AT/3,518  [FP-SOT162-1-MFG]

### Ports
25_CF2 (bidir, see Energy_meter_Sch[2D]), 26_CF1 (bidir, see Energy_meter_Sch[2D]), 27_IRQ (bidir, see Energy_meter_Sch[2C]), 28_RESET (bidir, see Energy_meter_Sch[2D]), 29_MOSI (bidir, see Energy_meter_Sch[2C]), 30_MISO (bidir, see Energy_meter_Sch[2C]), 31_SCLK (bidir, see Energy_meter_Sch[2C]), 32_SS (bidir, see Energy_meter_Sch[2C]), L_SHUNT_IN (in, see Energy_meter_Sch[4B]), L_SHUNT_OUT (out, see Energy_meter_Sch[2A]), Neutral (in, see Energy_meter_Sch[1B], Energy_meter_Sch[4B]), NUM_SCL (bidir, see Energy_meter_Sch[4C], EnergyMeter_ADE9153[1C]), NUM_SCL (bidir, see Energy_meter_Sch[4C], EnergyMeter_ADE9153[2D]), NUM_SDA (bidir, see Energy_meter_Sch[4C], EnergyMeter_ADE9153[1C]), NUM_SDA (bidir, see Energy_meter_Sch[4C], EnergyMeter_ADE9153[2D])

### Nets
+5: R60.2 R61.2 U?.16(VDD)
D: U?.8(VSS)
GND: ADE.1(DGND) ADE.9(AGND) ADE.17(AGND) ADE.19(IBMS) ADE.20(DGND) C11.1 C12.1 C13.1 C14.1 C15.1 C16.1 C17.1 C18.1 C19.1 C20.1 C21.1 C22.1 C23.1 C24.1 C25.2 C26.2 C28.1 C29.1 C30.1 C31.1 R59.2 SHUNT.3 SHUNT.4 U?.1(A0) U?.2(A1) U?.3(A2) ; port L_SHUNT_IN
2_DVDDOUT: ADE.2(DVDDOUT) C15.2 C16.2
3_CLKOUT: ADE.3(CLKOUT) C26.1 CRYS.2
4_CLKIN: ADE.4(CLKIN) C25.1 CRYS.1
5_VDD: ADE.5(VDD) C11.2 C12.2
6_IAMS: ADE.6(IAMS) R58.2 SHUNT.1 SHUNT.2 ; port L_SHUNT_OUT
7_IAN: ADE.7(IAN) C30.2 R59.1
8_IPN: ADE.8(IAP) C31.2 R58.1
10_VDDOUT: ADE.10(VDDOUT2P5) C17.2 C18.2
11_IBN: ADE.11(IBN) C28.2 R55.1
12_IBP: ADE.12(IBP) C29.2 R56.1
14_VAP: ADE.14(VAP) C27.1 R51.1 R52.2
15_VAN: ADE.13(VAMS) ADE.15(VAN) C27.2 R51.2
16_AVDDOUT: ADE.16(AVDDOUT) C21.2 C22.2
18_REFIN: ADE.18(REFIN) C23.2 C24.2
21_MSH: ADE.21(MSH) C19.2 C20.2
24_VDD: ADE.24(VDD) C13.2 C14.2
LCD_SCL: R61.1 U?.14(SCL) ; port NUM_SCL
LCD_SDA: R60.1 U?.15(SDA) ; port NUM_SDA
RF_MISO: ADE.30(MISO/TX) ; port 30_MISO
RF_MOSI: ADE.29(MOSI/RX) ; port 29_MOSI
RF_SCK: ADE.31(SCLK) ; port 31_SCLK
NetADE_22: ADE.22(FA1) C32.2
NetADE_23: ADE.23(FA0) C32.1
NetADE_25: ADE.25(ZX/DREADY/CF2) ; port 25_CF2
NetADE_26: ADE.26(CF1) ; port 26_CF1
NetADE_27: ADE.27(~{IRQ}) ; port 27_IRQ
NetADE_28: ADE.28(~{RESET}) ; port 28_RESET
NetADE_32: ADE.32(~{SS}) ; port 32_SS
Nethi-Link_2: R54.1 ; port Neutral
NetJ9_1: J9.1 R55.2 R57.1
NetJ9_2: J9.2 R56.2 R57.2
NetJ10_3: J10.3 U?.12(P7)
NetJ10_4: J10.4 U?.11(P6)
NetJ10_5: J10.5 U?.10(P5)
NetJ10_6: J10.6 U?.9(P4)
NetJ10_7: J10.7 U?.7(P3)
NetJ10_8: J10.8 U?.6(P2)
NetJ10_9: J10.9 U?.5(P1)
NetJ10_10: J10.10 U?.4(P0)
NetR52_1: R52.1 R53.2
NetR53_1: R53.1 R54.2

Not connected (* = marked no-connect by the designer): ADE 33(EP)*; J10 1* 2*; U? 13(~{INT})*

### Library data of the parts
ADE = CMP-09081-000635-1: 1 PH MTR IC W/AUTO CALIBRATION; Operating Supply Current: 9.3mA; Input Impedance: 256kR; Mount: Surface Mount; Packaging: Tape and Reel; RoHS Compliant: Yes; Number of Pins: 32; Min Operating Temperature: -40°C; Series: -; Max Operating Temperature: 85°C
C11 C13 C15 C17 C19 C21 C23 C28-C31 = CMP-2100-03644-1: Chip Capacitor, 0.1 uF, +/- 10%, 50 V, -55 to 125 degC, 0805 (2012 Metric), RoHS, Tape and Reel; Manufacturer: Murata; Voltage: 50V; Capacitance: 100nF; Insulation Resistance: 10GR; Dielectric Material: Ceramic; Dielectric: X7R; Package Description: 2-Pin Surface Mount Device, Body 2 x 1.25 mm; Manufacturer URL: http://www.murata.com/; Case Code (Imperial): 0805; Datasheet URL: http://psearch.en.murata.com/capacitor/product/GRM21BR71H104KA01%23.pdf; Termination: SMD/SMT; Lead Free: LeadFree; Package Quantity: 1; Mount: SurfaceMount; REACH SVHC: Unknown; Thickness: 0.053inch; Height: 1.25mm; Case/Package: 0805; Voltage Rating: 50V; Width: 0.049inch; Case Code (Metric): 2012; Material: Ceramic; Min Operating Temperature: -55degC; RoHSCompliant: true; Datasheet Version: 42675.0; Voltage Rating (DC): 50V; Tolerance: 10%; Package Reference: 0805; Depth: 1.25mm; Length: 2mm; Max Operating Temperature: 125degC; Packaging: TapeandReel; Number of Pins: 2; Radiation Hardening: No
C12 C14 C16 C18 C20 C22 C24 = CMP-2007-03546-1: Manufacturer: Murata; Part Number: GRM21BR61E475MA12L
C25 C26 = CMP-2007-04866-1: Manufacturer: AVX Interconnect / Elco; Part Number: 08052U220GAT2A
C27 = CMP-1036-04480-3: Manufacturer: AVX Interconnect / Elco; Part Number: 08053C154KAT2A
C32 = CMP-1036-04645-2: CAP CER 0.47UF 25V X7R 0805; Manufacturer: KEMET; Manufacturer Part Number: C0805C474K3RACTU; Material: Ceramic; Value: 0.47 μF; Tolerance: 0.1; Temperature Coefficient: 30ppm/°C; Lead Free: Yes; Device Class L1: Passive Components; ComponentLink2Description: Datasheet; Category: Cap; Temperature: -55°C to +125°C; RoHS: TRUE; Capacitance: 0.47 μF; Automotive: No; Height: 0.88mm; Digikey Description: CAP CER 0.47UF 25V X7R 0805; Device Class L3: Ceramic Capacitors; Package: C0805C-DN; Voltage Rating: 25 V; Octopart: https://octopart.com/c0805c474k3ractu-kemet-90785; Temperature Characteristic: X7R; Temperature Range Low: -55°C; Temperature Range High: +125°C; Device Class L2: Capacitors; Ipc Land Pattern Name: CAPC200125X78; ComponentLink2URL: https://content.kemet.com/datasheets/KEM_C1003_C0G_SMD.pdf
CRYS = CMP-00466-07122495-1: ECS-120-18-5PXDU-TR Crystal 12MHz ±30ppm (Tol) ±100ppm (Stability) 18pF FUND 50Ohm 2-Pin SMD T/R; Tolerance: 0.003%; ESR (Equivalent Series Resistance): 50Ω; Termination: SMD/SMT; Width: 4.8006mm; Length: 11.4046mm; Packaging: Tape & Reel (TR); Max Operating Temperature: 125°C; Load Capacitance: 18pF; Frequency Stability: 100ppm; Lead Free: Lead Free; Min Operating Temperature: -55°C; RoHS: Compliant; Frequency: 12MHz; Schedule B: 8541600025, 8541600025; Frequency Tolerance: 0.003%; Mount: Surface Mount; Height: 4.2926mm; NexarPartId: 7122495
J9 = CMP-1502-02464-2: NexarPartId: 18818288; Plating: Brass, Steel; Current: 10A; Pitch: 3.5052mm; Number of Levels: 1; Number of Contacts: 2; Wire Gauge (Min): 16AWG; Voltage: 300V; Wire Gauge (Max): 24AWG; Stripping Length: -6mm; Number of Pins: 2; Number of Rows: 1; REACH SVHC: Unknown; RoHS: Compliant; Housing Material: Nylon; Termination: Screw; Mount: Through Hole; Contact Plating: Brass, Tin; Number of Positions Per Level: 2; Color: Blue, Green; Width: 7.9mm; Voltage Rating: 300V; Length: 7.4mm; Current Rating: 10A; Wire/Cable Gauge: 24AWG; Packaging: Box; Max Operating Temperature: 105°C; Lead Pitch: 3.5mm; Height: 8.7mm; Contact Material: Brass; Min Operating Temperature: -40°C
J10 = CMP-17439-000145-1: as J5 on sheet Energy_meter_Sch; Series: XH; Max Current Rating: 3A; Contact Shape: Square; Contact Material: Brass; Housing Material: Polyamide; Lead Free: Lead Free; Orientation: Straight; Max Voltage Rating (DC): 250V; Contact Type: Male Pin; Number of Positions: 10; Length: 27.4mm; Housing Color: White; Max Voltage Rating (AC): 250V; Depth: 5.75mm; Mount: Through Hole; Pitch: 2.5mm; Fastening Type: Detent; Flammability Rating: UL94 V-0; Color: Natural; Contact Plating: Tin; Insulation Color: Natural; Packaging: Bulk; REACH SVHC: No SVHC; Insulation Material: Nylon; Connector Type: Header; Lead Pitch: 2.5mm; Contact Finish - Mating: TIN; Voltage Rating (AC): 250V; Number of Rows: 1; Max Operating Temperature: 85°C; Min Operating Temperature: -25°C; Termination: Solder
R51 = CMP-2100-03671-1: as R10 on sheet Energy_meter_Sch; Number of Pins: 2; Number of Terminations: 2; Datasheet URL: http://www.yageo.com/NewPortal/yageodocoutput?fileName=/pdf/R-Chip/PYu-RC_Group_51_RoHS_L_5.pdf; Length: 0.079inch; Package Description: 2-Pin Surface Mounted Device, Body 2 x 1.25 mm; Depth: 1.25mm; Height: 0.024inch; Military Standard: Not; Case/Package: 0805; Package Reference: 0805; RoHSCompliant: true; Lead Free: LeadFree; Packaging: TapeandReel; Package Quantity: 1; Datasheet Version: Rev. 5, 10/2016; Tolerance: 1%; Min Operating Temperature: -55degC; Voltage Rating: 150V; Composition: ThickFilm; Case Code (Imperial): 0805; Power Rating: 125mW; Width: 0.049inch; Case Code (Metric): 2012; Manufacturer URL: http://www.yageo.com/; Max Operating Temperature: 155degC; REACH SVHC: Unknown; Termination: SMD/SMT
R52-R54 = CMP-2001-00535-1: Manufacturer: Panasonic; Part Number: ERJ6ENF3303V
R55 R56 R58 R59 = CMP-2001-00596-1: Manufacturer: Panasonic; Part Number: ERA6AEB151V
R57 = CMP-26527-003152-1: General Purpose Thick Film Chip Resistor, 0805, 0.5Ω, 5%, 200ppm/°C, 0.25W; RoHS Compliant: Yes; Max Operating Temperature: 155°C; Min Operating Temperature: -55°C; Tolerance: 5%; Mount: Surface Mount; Packaging: Tape and Reel
R60 R61 = CMP-2001-00590-1: as R4 on sheet Energy_meter_Sch
SHUNT = WSK12161L000FEA: 1 mOhms Â±1% 3W Chip Resistor Wide 1612 (3831 Metric), 1216 Current Sense, Moisture Resistant, Pulse Withstanding Metal Element; MF: Vishay Dale; MP: WSK12161L000FEA; Package: 1216 Vishay Dale; Purchase-URL: https://pricing.snapeda.com/search/part/WSK12161L000FEA/?ref=eda; Check_prices: https://www.snapeda.com/parts/WSK12161L000FEA/Vishay%20Dale/view-part/3217927/?ref=eda; Digi-Key_Part_Number: 541-3133-1-ND; SnapEDA_Link: https://www.snapeda.com/parts/WSK12161L000FEA/Vishay%20Dale/view-part/3217927/?ref=snap; Value: *
U? = CMP-10112-000003-1: IC I/O EXPANDER I2C 8B 16SOIC; Manufacturer: NXP Semiconductors; Interface: I2C,SMBus; Frequency: 100kHz; Nominal Supply Current: 40uA; Max Supply Voltage: 6V; Number Of I/Os: 8; Max Junction Temp: +125°C; Min Supply Voltage: 2.5V; Standoff Height: 0.1mm; RoHS: TRUE; Category: IC; Temperature: -40°C to +85°C; Device Class L3: I/O Expanders; ComponentLink2Description: Datasheet; ComponentLink2URL: https://www.nxp.com/docs/en/data-sheet/PCF8574_PCF8574A.pdf; Digikey Description: IC I/O EXPANDER I2C 8B 16SOIC; Ipc Land Pattern Name: SOIC127P1032X265-16; Mouser Description: PCF8574 Series 2.5 to 6V Remote 8-bit I/O Expander for I2C-bus -SOIC-16; Footprint Url: https://www.nxp.com/docs/en/package-information/SOT162-1.pdf; Lead Free: Yes; Device Class L2: Interface ICs; Ambient Temperature Range Low: -40°C; Temperature Range High: +85°C; Automotive: No; Manufacturer Part Number: PCF8574AT/3,518; Ambient Temperature Range High: +85°C; Height: 2.65mm; Package: SOT162-1; Temperature Range Low: -40°C; Octopart: https://octopart.com/pcf8574at%2F3%2C518-nxp+semiconductors-11541925; Device Class L1: Integrated Circuits (ICs)

## Nets that join several sheets
+5: Energy_meter_Sch (5 pins), EnergyMeter_ADE9153 (R60.2 R61.2 U?.16)
GND: Energy_meter_Sch (35 pins), EnergyMeter_ADE9153 (31 pins)
6_IAMS: Energy_meter_Sch (Relay.3), EnergyMeter_ADE9153 (ADE.6 R58.2 SHUNT.1 SHUNT.2)
LCD_SCL: Energy_meter_Sch (ESP32.36 J4.1), EnergyMeter_ADE9153 (R61.1 U?.14)
LCD_SDA: Energy_meter_Sch (ESP32.33 J4.2), EnergyMeter_ADE9153 (R60.1 U?.15)
NetADE_25: Energy_meter_Sch (ESP32.7), EnergyMeter_ADE9153 (ADE.25)
NetADE_26: Energy_meter_Sch (ESP32.8), EnergyMeter_ADE9153 (ADE.26)
NetADE_27: Energy_meter_Sch (ESP32.10), EnergyMeter_ADE9153 (ADE.27)
NetADE_28: Energy_meter_Sch (ESP32.9), EnergyMeter_ADE9153 (ADE.28)
NetADE_32: Energy_meter_Sch (ESP32.29), EnergyMeter_ADE9153 (ADE.32)
Nethi-Link_2: Energy_meter_Sch (hi-Link.2 J6.2 MOV.1), EnergyMeter_ADE9153 (R54.1)
RF_MISO: Energy_meter_Sch (ESP32.31 J5.7 J11.4), EnergyMeter_ADE9153 (ADE.30)
RF_MOSI: Energy_meter_Sch (ESP32.37 J5.8 J11.3), EnergyMeter_ADE9153 (ADE.29)
RF_SCK: Energy_meter_Sch (ESP32.30 J5.9 J11.2), EnergyMeter_ADE9153 (ADE.31)